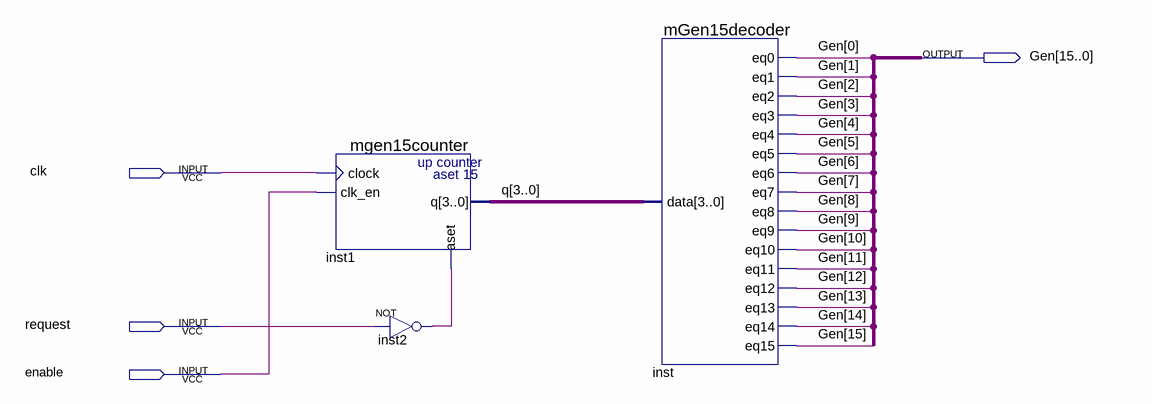
[diagram p0: schematic sheet]
// Quartus schematic mGen15.bdf as structural Verilog: 3 symbols, 4 pins
module mGen15 (
  input  clk,
  input  request,
  input  enable,
  output [15:0] Gen
);

  wire inst2_out;
  wire [3:0] q;

  mgen15counter inst1 (.clock(clk), .clk_en(enable), .aset(inst2_out), .q(q));
  not inst2 (inst2_out, request);
  mGen15decoder inst (
    .data(q), .eq0(Gen[0]), .eq1(Gen[1]), .eq2(Gen[2]), .eq3(Gen[3]), .eq4(Gen[4]), .eq5(Gen[5]),
    .eq6(Gen[6]), .eq7(Gen[7]), .eq8(Gen[8]), .eq9(Gen[9]), .eq10(Gen[10]), .eq11(Gen[11]), .eq12(Gen[12]),
    .eq13(Gen[13]), .eq14(Gen[14]), .eq15(Gen[15]));
endmodule
